# Altium schematic sheet lora.SchDoc: E22-900 LoRa Sheet
size A4; Revision: 1; SheetNumber: 3; SheetTotal: 8
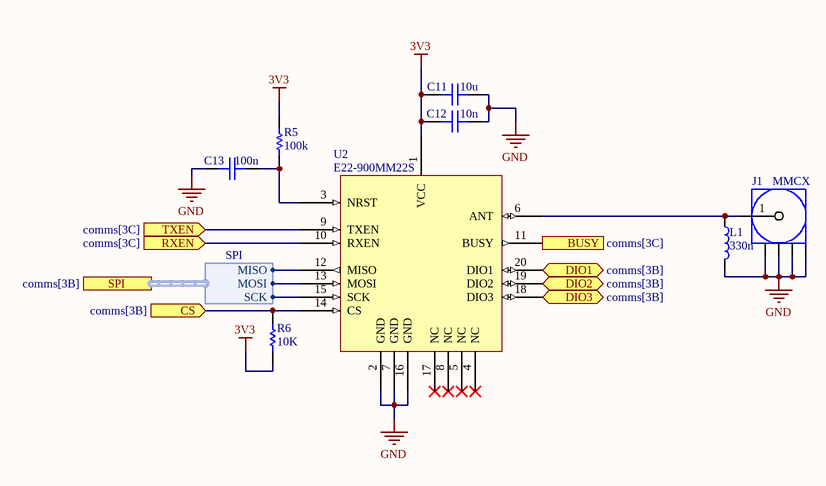
[diagram p0: lora.SchDoc]

## Parts
C11  10u
C12  10n
C13  100n
J1  MMCX
L1  330n
R5  100k
R6  10K
U2  E22-900MM22S

## Ports
BUSY (out, see comms[3C]), CS (in, see comms[3B]), DIO1 (bidir, see comms[3B]), DIO2 (bidir, see comms[3B]), DIO3 (bidir, see comms[3B]), RXEN (in, see comms[3C]), SPI (harness SPI, see comms[3B]), TXEN (in, see comms[3C])

## Harnesses
SPI: MISO, MOSI, SCK

## Nets
3V3: C11.2 C12.2 R5.2 R6.1 U2.1(VCC)
GND: C11.1 C12.1 C13.2 J1.2 J1.3 J1.4 J1.5 L1.2 U2.2(GND) U2.7(GND) U2.16(GND)
BUSY: U2.11(BUSY) ; port BUSY
CS: R6.2 U2.14(CS) ; port CS
DIO1: U2.20(DIO1) ; port DIO1
DIO2: U2.19(DIO2) ; port DIO2
DIO3: U2.18(DIO3) ; port DIO3
RXEN: U2.10(RXEN) ; port RXEN
TXEN: U2.9(TXEN) ; port TXEN
NetC13_1: C13.1 R5.1 U2.3(NRST)
NetJ1_1: J1.1 L1.1 U2.6(ANT)
NetU2_12: U2.12(MISO) ; port SPI.MISO
NetU2_13: U2.13(MOSI) ; port SPI.MOSI
NetU2_15: U2.15(SCK) ; port SPI.SCK

Not connected (* = marked no-connect by the designer): U2 4(NC)* 5(NC)* 8(NC)* 17(NC)*

## Library data of the parts
C11-C13 = Capacitor
J1 = Conn_Coaxial: Coaxial Connector
L1 = Inductor
R5 R6 = Resistor
U2 = E22-900MM22S: SX1262 868/915MHz ultra small size Lora SMD module